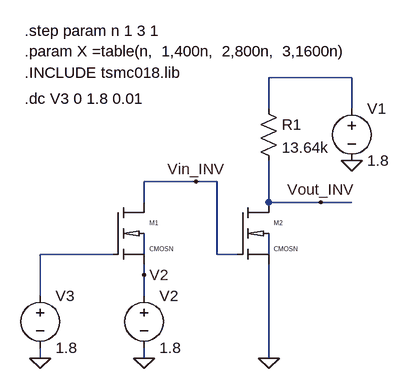
[diagram p0: schematic 1E_NMOS_GATE_DRIVING_L_TO_H.asc]
1E_NMOS_GATE_DRIVING_L_TO_H.asc, the LTspice schematic file:
Version 4
SHEET 1 1360 680
WIRE 464 -80 336 -80
WIRE 336 -32 336 -80
WIRE 464 -32 464 -80
WIRE 224 80 144 80
WIRE 256 80 224 80
WIRE 144 112 144 80
WIRE 336 112 336 48
WIRE 416 112 336 112
WIRE 464 112 416 112
WIRE 96 192 -16 192
WIRE 144 192 144 160
WIRE 256 192 256 80
WIRE 288 192 256 192
WIRE 336 192 336 160
WIRE 144 224 144 208
WIRE -16 256 -16 192
WIRE 144 256 144 224
WIRE -16 352 -16 336
WIRE 144 352 144 336
WIRE 336 352 336 208
FLAG 464 48 0
FLAG 144 352 0
FLAG 336 352 0
FLAG 224 80 Vin_INV
FLAG 416 112 Vout_INV
FLAG -16 352 0
FLAG 144 224 V2
SYMBOL cmosn 288 112 R0
SYMATTR InstName M2
SYMATTR Value2 l=180n w=400n
SYMBOL res 320 -48 R0
SYMATTR InstName R1
SYMATTR Value 13.64k
SYMBOL voltage 464 -48 R0
WINDOW 123 0 0 Left 0
WINDOW 39 0 0 Left 0
SYMATTR InstName V1
SYMATTR Value 1.8
SYMBOL voltage 144 240 R0
WINDOW 123 0 0 Left 0
WINDOW 39 0 0 Left 0
SYMATTR InstName V2
SYMATTR Value 1.8
SYMBOL voltage -16 240 R0
WINDOW 123 0 0 Left 0
WINDOW 39 0 0 Left 0
SYMATTR InstName V3
SYMATTR Value 1.8
SYMBOL cmosn 96 112 R0
SYMATTR InstName M1
SYMATTR Value2 l=180n w=X
TEXT -40 -88 Left 2 !.INCLUDE tsmc018.lib
TEXT -40 -152 Left 2 !.step param n 1 3 1\n.param X =table(n,  1,400n,  2,800n,  3,1600n)
TEXT -40 -48 Left 2 !.dc V3 0 1.8 0.01

The netlist it stands for:
* 1E_NMOS_GATE_DRIVING_L_TO_H.asc
M2 Vout_INV Vin_INV 0 N004 CMOSN l=180n w=400n
R1 N001 Vout_INV 13.64k
V1 N001 0 1.8
V2 V2 0 1.8
V3 N002 0 1.8
M1 Vin_INV N002 V2 N003 CMOSN l=180n w=X
.model NMOS NMOS
.model PMOS PMOS
.lib standard.mos
.INCLUDE tsmc018.lib
.step param n 1 3 1
.param X =table(n,  1,400n,  2,800n,  3,1600n)
.dc V3 0 1.8 0.01
.lib tsmc018.lib
.backanno
.end

* Results of the author's LTspice run, read from the files saved beside the schematic
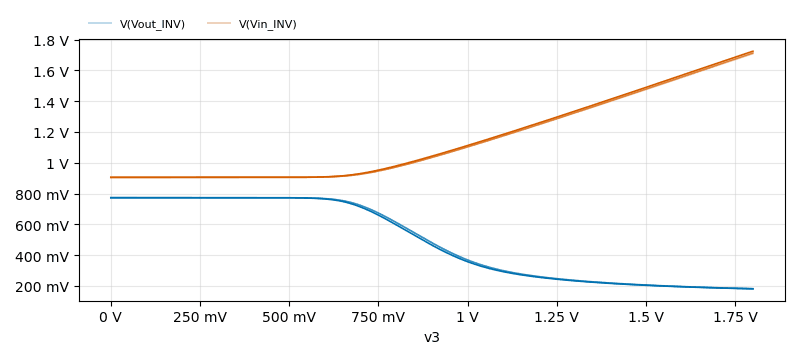
[diagram p1: DC transfer characteristic of 1E_NMOS_GATE_DRIVING_L_TO_H.asc, plotted from the saved traces]
* DC transfer characteristic, 3 runs:
*   V(Vout_INV) [n=1]: 772.9 mV at v3=0 V, 182.2 mV at v3=1.8 V, min 182.2 mV, max 772.9 mV
*   V(Vout_INV) [n=2]: 772.9 mV at v3=0 V, 181.9 mV at v3=1.8 V, min 181.9 mV, max 772.9 mV
*   V(Vout_INV) [n=3]: 772.9 mV at v3=0 V, 181.1 mV at v3=1.8 V, min 181.1 mV, max 772.9 mV
*   V(Vin_INV) [n=1]: 905 mV at v3=0 V, 1.708 V at v3=1.8 V, min 905 mV, max 1.708 V
*   V(Vin_INV) [n=2]: 905 mV at v3=0 V, 1.713 V at v3=1.8 V, min 905 mV, max 1.713 V
*   V(Vin_INV) [n=3]: 905 mV at v3=0 V, 1.724 V at v3=1.8 V, min 905 mV, max 1.724 V